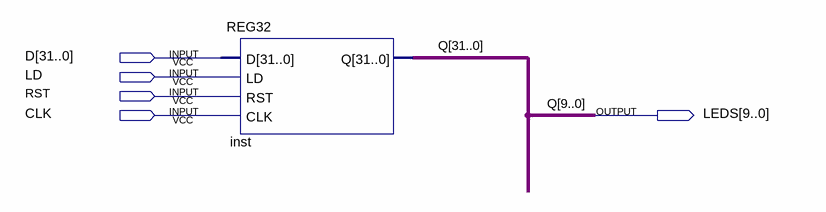
[diagram p0: schematic sheet]
// Quartus schematic LED.bdf as structural Verilog: 1 symbols, 5 pins
module LED (
  input  [31:0] D,
  input  LD,
  input  RST,
  input  CLK,
  output [9:0] LEDS
);

  wire [31:10] Q;

  REG32 inst (.D(D), .LD(LD), .RST(RST), .CLK(CLK), .Q({Q, LEDS}));

  // Other names for the same wires on the sheet: Q[9:0] = LEDS
endmodule
